# Altium schematic sheet fre_oa.SchDoc
size A4
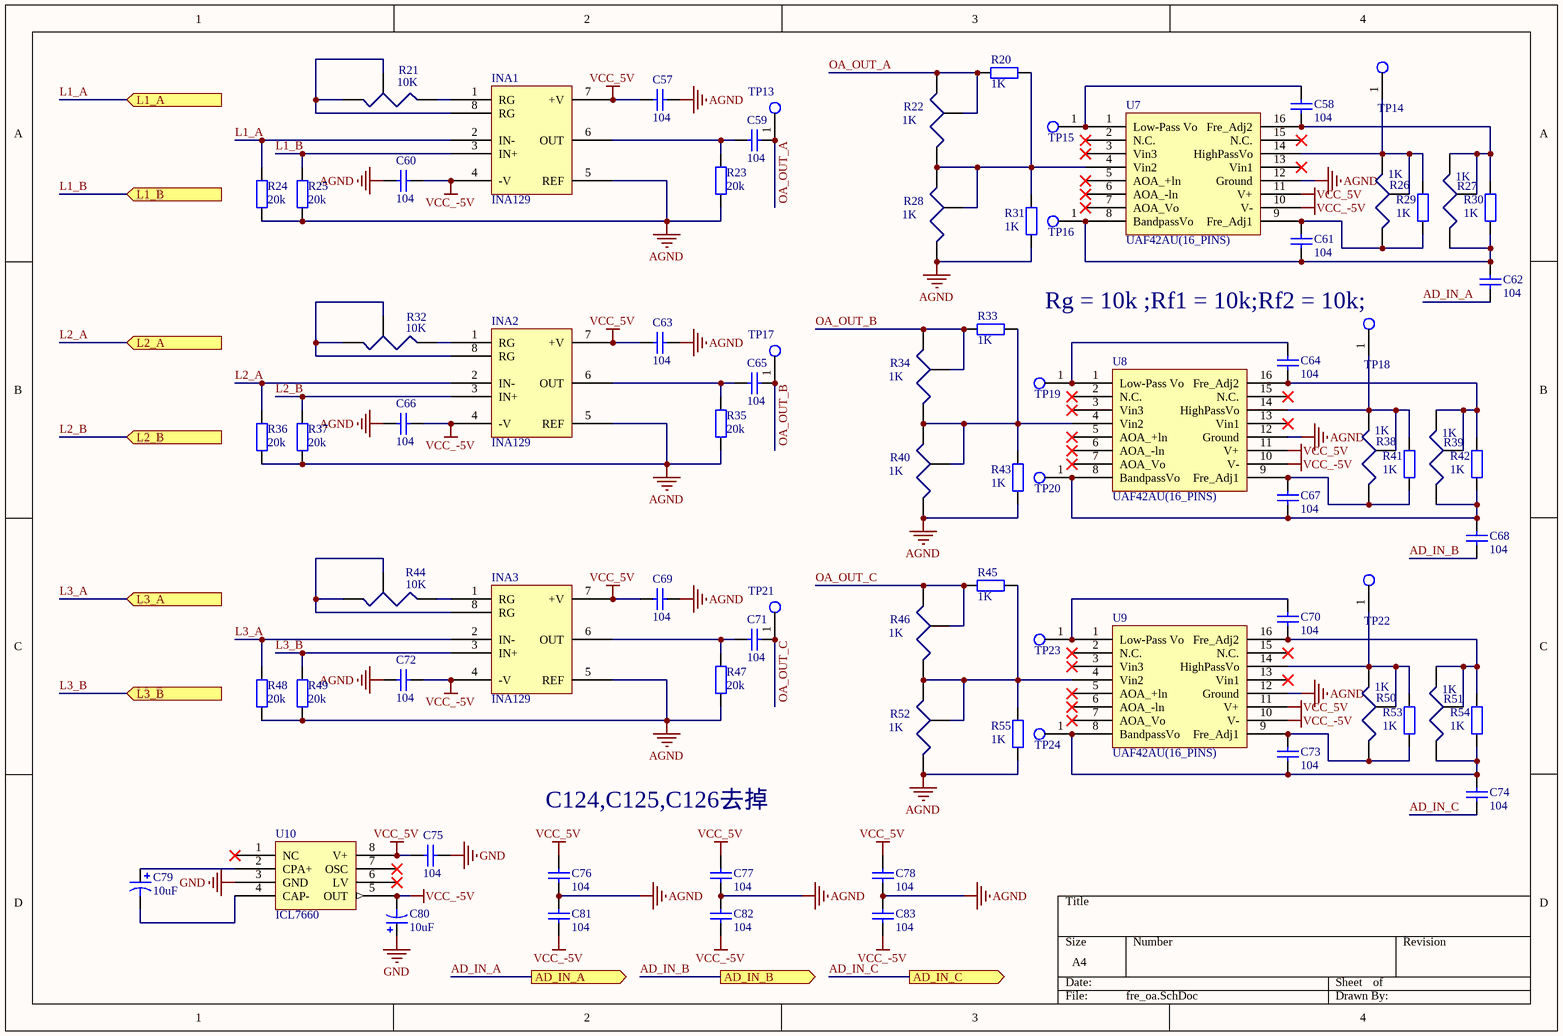
[diagram p0: fre_oa.SchDoc]

## Parts
C57  value 104  [0805]  (hidden comment: Cap)
C58  value 104  [0805]  (hidden comment: Cap)
C59  value 104  [0805]  (hidden comment: Cap)
C60  value 104  [0805]  (hidden comment: Cap)
C61  value 104  [0805]  (hidden comment: Cap)
C62  value 104  [0805]  (hidden comment: Cap)
C63  value 104  [0805]  (hidden comment: Cap)
C64  value 104  [0805]  (hidden comment: Cap)
C65  value 104  [0805]  (hidden comment: Cap)
C66  value 104  [0805]  (hidden comment: Cap)
C67  value 104  [0805]  (hidden comment: Cap)
C68  value 104  [0805]  (hidden comment: Cap)
C69  value 104  [0805]  (hidden comment: Cap)
C70  value 104  [0805]  (hidden comment: Cap)
C71  value 104  [0805]  (hidden comment: Cap)
C72  value 104  [0805]  (hidden comment: Cap)
C73  value 104  [0805]  (hidden comment: Cap)
C74  value 104  [0805]  (hidden comment: Cap)
C75  value 104  [0805]  (hidden comment: Cap)
C76  value 104  [0805]  (hidden comment: Cap)
C77  value 104  [0805]  (hidden comment: Cap)
C78  value 104  [0805]  (hidden comment: Cap)
C79  value 10uF  [Cap 3528B]  (hidden comment: Cap Poll)
C80  value 10uF  [Cap 3528B]  (hidden comment: Cap Poll)
C81  value 104  [0805]  (hidden comment: Cap)
C82  value 104  [0805]  (hidden comment: Cap)
C83  value 104  [0805]  (hidden comment: Cap)
INA1  INA129  [LM386]
INA2  INA129  [LM386]
INA3  INA129  [LM386]
R20  value 1K  [0805]  (hidden comment: Res)
R21  value 10K  [电位器WH06-2C]  (hidden comment: 电位器)
R22  value 1K  [电位器WH06-2C]  (hidden comment: 电位器)
R23  value 20k  [0805]  (hidden comment: Res)
R24  value 20k  [0805]  (hidden comment: Res)
R25  value 20k  [0805]  (hidden comment: Res)
R26  value 1K  [电位器WH06-2C]  (hidden comment: 电位器)
R27  value 1K  [电位器WH06-2C]  (hidden comment: 电位器)
R28  value 1K  [电位器WH06-2C]  (hidden comment: 电位器)
R29  value 1K  [0805]  (hidden comment: Res)
R30  value 1K  [0805]  (hidden comment: Res)
R31  value 1K  [0805]  (hidden comment: Res)
R32  value 10K  [电位器WH06-2C]  (hidden comment: 电位器)
R33  value 1K  [0805]  (hidden comment: Res)
R34  value 1K  [电位器WH06-2C]  (hidden comment: 电位器)
R35  value 20k  [0805]  (hidden comment: Res)
R36  value 20k  [0805]  (hidden comment: Res)
R37  value 20k  [0805]  (hidden comment: Res)
R38  value 1K  [电位器WH06-2C]  (hidden comment: 电位器)
R39  value 1K  [电位器WH06-2C]  (hidden comment: 电位器)
R40  value 1K  [电位器WH06-2C]  (hidden comment: 电位器)
R41  value 1K  [0805]  (hidden comment: Res)
R42  value 1K  [0805]  (hidden comment: Res)
R43  value 1K  [0805]  (hidden comment: Res)
R44  value 10K  [电位器WH06-2C]  (hidden comment: 电位器)
R45  value 1K  [0805]  (hidden comment: Res)
R46  value 1K  [电位器WH06-2C]  (hidden comment: 电位器)
R47  value 20k  [0805]  (hidden comment: Res)
R48  value 20k  [0805]  (hidden comment: Res)
R49  value 20k  [0805]  (hidden comment: Res)
R50  value 1K  [电位器WH06-2C]  (hidden comment: 电位器)
R51  value 1K  [电位器WH06-2C]  (hidden comment: 电位器)
R52  value 1K  [电位器WH06-2C]  (hidden comment: 电位器)
R53  value 1K  [0805]  (hidden comment: Res)
R54  value 1K  [0805]  (hidden comment: Res)
R55  value 1K  [0805]  (hidden comment: Res)
TP13  testPoint  [TP_H]  (value not drawn)
TP14  testPoint  [TP_H]  (value not drawn)
TP15  testPoint  [TP_H]  (value not drawn)
TP16  testPoint  [TP_H]  (value not drawn)
TP17  testPoint  [TP_H]  (value not drawn)
TP18  testPoint  [TP_H]  (value not drawn)
TP19  testPoint  [TP_H]  (value not drawn)
TP20  testPoint  [TP_H]  (value not drawn)
TP21  testPoint  [TP_H]  (value not drawn)
TP22  testPoint  [TP_H]  (value not drawn)
TP23  testPoint  [TP_H]  (value not drawn)
TP24  testPoint  [TP_H]  (value not drawn)
U7  UAF42AU(16_PINS)  [SOIC127P1030X265-16N]
U8  UAF42AU(16_PINS)  [SOIC127P1030X265-16N]
U9  UAF42AU(16_PINS)  [SOIC127P1030X265-16N]
U10  ICL7660  [ICL7660 sop-8]

## Ports
AD_IN_A (out), AD_IN_B (out), AD_IN_C (out), L1_A (in), L1_B (in), L2_A (in), L2_B (in), L3_A (in), L3_B (in)

## Nets
AGND: C57.2 C60.1 C63.2 C66.1 C69.2 C72.1 C76.1 C77.1 C78.1 C81.2 C82.2 C83.2 INA1.5(REF) INA2.5(REF) INA3.5(REF) R23.1 R24.1 R25.1 R28.1 R31.1 R35.1 R36.1 R37.1 R40.1 R43.1 R47.1 R48.1 R49.1 R52.1 R55.1 U7.12(Ground) U8.12(Ground) U9.12(Ground)
GND: C75.2 C80.1 U10.3(GND)
VCC_5V: C57.1 C63.1 C69.1 C75.1 C76.2 C77.2 C78.2 INA1.7(+V) INA2.7(+V) INA3.7(+V) U7.11(V+) U8.11(V+) U9.11(V+) U10.8(V+)
VCC_-5V: C60.2 C66.2 C72.2 C80.2 C81.1 C82.1 C83.1 INA1.4(-V) INA2.4(-V) INA3.4(-V) U7.10(V-) U8.10(V-) U9.10(V-) U10.5(OUT)
AD_IN_A: C62.2 ; port AD_IN_A
AD_IN_B: C68.2 ; port AD_IN_B
AD_IN_C: C74.2 ; port AD_IN_C
L1_A: INA1.2(IN-) R24.2 ; port L1_A
L1_B: INA1.3(IN+) R25.2 ; port L1_B
L2_A: INA2.2(IN-) R36.2 ; port L2_A
L2_B: INA2.3(IN+) R37.2 ; port L2_B
L3_A: INA3.2(IN-) R48.2 ; port L3_A
L3_B: INA3.3(IN+) R49.2 ; port L3_B
OA_OUT_A: C59.2 R20.1 R22.2 R22.3 TP13.1
OA_OUT_B: C65.2 R33.1 R34.2 R34.3 TP17.1
OA_OUT_C: C71.2 R45.1 R46.2 R46.3 TP21.1
NetC58_1: C58.1 TP15.1 U7.1(Low-Pass_Vo)
NetC58_2: C58.2 R27.2 R27.3 R30.2 U7.16(Fre_Adj2)
NetC59_1: C59.1 INA1.6(OUT) R23.2
NetC61_1: C61.1 R26.1 R29.1 U7.9(Fre_Adj1)
NetC61_2: C61.2 C62.1 R27.1 R30.1 TP16.1 U7.8(BandpassVo)
NetC64_1: C64.1 TP19.1 U8.1(Low-Pass_Vo)
NetC64_2: C64.2 R39.2 R39.3 R42.2 U8.16(Fre_Adj2)
NetC65_1: C65.1 INA2.6(OUT) R35.2
NetC67_1: C67.1 R38.1 R41.1 U8.9(Fre_Adj1)
NetC67_2: C67.2 C68.1 R39.1 R42.1 TP20.1 U8.8(BandpassVo)
NetC70_1: C70.1 TP23.1 U9.1(Low-Pass_Vo)
NetC70_2: C70.2 R51.2 R51.3 R54.2 U9.16(Fre_Adj2)
NetC71_1: C71.1 INA3.6(OUT) R47.2
NetC73_1: C73.1 R50.1 R53.1 U9.9(Fre_Adj1)
NetC73_2: C73.2 C74.1 R51.1 R54.1 TP24.1 U9.8(BandpassVo)
NetC79_1: C79.1 U10.2(CPA+)
NetC79_2: C79.2 U10.4(CAP-)
NetINA1_1: INA1.1(RG) R21.1
NetINA1_8: INA1.8(RG) R21.2 R21.3
NetINA2_1: INA2.1(RG) R32.1
NetINA2_8: INA2.8(RG) R32.2 R32.3
NetINA3_1: INA3.1(RG) R44.1
NetINA3_8: INA3.8(RG) R44.2 R44.3
NetR20_2: R20.2 R22.1 R28.2 R28.3 R31.2 U7.4(Vin2)
NetR26_2: R26.2 R26.3 R29.2 TP14.1 U7.14(HighPassVo)
NetR33_2: R33.2 R34.1 R40.2 R40.3 R43.2 U8.4(Vin2)
NetR38_2: R38.2 R38.3 R41.2 TP18.1 U8.14(HighPassVo)
NetR45_2: R45.2 R46.1 R52.2 R52.3 R55.2 U9.4(Vin2)
NetR50_2: R50.2 R50.3 R53.2 TP22.1 U9.14(HighPassVo)

Not connected (* = marked no-connect by the designer): U7 2(N.C.)* 3(Vin3)* 5(AOA_+ln)* 6(AOA_-ln)* 7(AOA_Vo)* 13(Vin1)* 15(N.C.)*; U8 2(N.C.)* 3(Vin3)* 5(AOA_+ln)* 6(AOA_-ln)* 7(AOA_Vo)* 13(Vin1)* 15(N.C.)*; U9 2(N.C.)* 3(Vin3)* 5(AOA_+ln)* 6(AOA_-ln)* 7(AOA_Vo)* 13(Vin1)* 15(N.C.)*; U10 1(NC)* 6(LV)* 7(OSC)*

## Notes on the sheet
- (near TP18) Rg = 10k ;Rf1 = 10k;Rf2 = 10k;
- C124,C125,C126去掉

## Library data of the parts
C57-C78 C81-C83 = Cap: 原理图绘制者: 刘永钦; 原理图何处使用过: 2014年飞思卡尔底板; 原理图审核人1: 徐鹏飞; 封装0805何处使用: 2015年航行器遥控器; 原理图审核人2: 朱觉文; 封装0603何处使用过: 在2401转接板上使用; Pressure Voltage: 16V; 原理图提供者: 刘永钦; 封装0805绘制者: 刘永钦; 封装0805提供者: 刘永钦; 封装0805审核人1: 徐鹏飞; 封装0805审核人2: 朱觉文; 封装0603绘制者: 刘永钦; 封装0603提供者: 刘永钦; 封装0603审核人1: 朱觉文; 封装0603审核人2: 徐鹏飞
C79 C80 = Cap Poll: 原理图绘制者: 刘永钦; 原理图何处使用过: 2014年飞思卡尔底板; 原理图审核人1: 徐鹏飞; 封装CAP 钽 7343 E何处使用: 2014年飞思卡尔驱动板; 封装cap贴片铝电解质470uF 16V绘制者: 李泽; 封装cap贴片铝电解质470uF 16V何处使用: 2015年飞思卡尔主板; 封装Cap 3528B绘制者: 陈汉诚; 封装Cap 3528B使用过: 2015年飞思卡尔驱动板; 封装Cap直插 10uF 50V: 10级718学长; 封装Cap直插 10uF 50V使用过: 2012年XS128学习板的主板; 封装Cap 3528B审核人2: 朱觉文; Pressure Voltage: 16V; 原理图提供者: 刘永钦; 封装CAP 钽 7343 E绘制者: 刘永钦; 封装CAP 钽 7343 E提供者: 刘永钦; 封装CAP 钽 7343 E审核人1: 徐鹏飞; 封装cap贴片铝电解质470uF 16V提供者: 刘永钦; 封装cap贴片铝电解质470uF 16V审核人1: 徐鹏飞; 封装Cap 3528B提供者: 刘永钦; 封装Cap 3528B审核人1: 徐鹏飞; 封装Cap直插 10uF 50V提供者: 刘永钦; 封装Cap直插 10uF 50V审核人1: 徐鹏飞; 封装Cap直插 10uF 50V审核人2: 朱觉文; 封装cap贴片铝电解质470uF 16V审核人2: 朱觉文; 封装CAP 钽 7343 E审核人2: 朱觉文; 原理图审核人2: 朱觉文
R20 R23-R25 R29-R31 R33 R35-R37 R41-R43 R45 R47-R49 R53-R55 = Res: 原理图绘制者: 刘永钦; 原理图何处使用过: 2014年飞思卡尔底板; 原理图审核人1: 徐鹏飞; 封装0805何处使用过: 2015年航行器遥控器; 原理图审核人2: 朱觉文; 封装2512-RESC6332X06N何处使用过: 在无刷直流电机驱动板上使用过; 封装0603何处使用过: 在2401转接板上使用; 原理图提供者: 刘永钦; 封装0805绘制者: 刘永钦; 封装0805提供者: 刘永钦; 封装0805审核人1: 徐鹏飞; 封装0805审核人2: 朱觉文; 封装0603提供者: 刘永钦; 封装0603审核人2: 朱觉文; 封装0603审核人1: 徐鹏飞; 封装2512-RESC6332X06N审核人2: 朱觉文; 封装2512-RESC6332X06N提供者: 刘永钦; 封装2512-RESC6332X06N审核人1: 徐鹏飞; 封装0603绘制者: 刘永钦; 封装2512-RESC6332X06N绘制者: 刘永钦
R21 R22 R26-R28 R32 R34 R38-R40 R44 R46 R50-R52 = 电位器: 原理图绘制者: 刘永钦; 原理图何处使用过: 2014年飞思卡尔底板; 原理图审核人1: 徐鹏飞; 封装电位器WH06-2C使用过: 2014年小板子; 封装电位器 097单联弯脚使用过: 2015年航行器遥控器; 原理图审核人2: 朱觉文; 原理图提供者: 刘永钦; 封装电位器WH06-2C绘制者: 刘永钦; 封装电位器WH06-2C审核人1: 徐鹏飞; 封装电位器WH06-2C提供者: 刘永钦; 封装电位器 097单联弯脚绘制者: 刘永钦; 封装电位器 097单联弯脚提供者: 刘永钦; 封装电位器 097单联弯脚审核人1: 徐鹏飞; 封装电位器 097单联弯脚审核人2: 朱觉文; 封装电位器WH06-2C审核人2: 朱觉文
TP13-TP24 = TP
U10 = ICL7660: 原理图绘制者: 刘永钦; 原理图何处使用过: 2014年飞思卡尔底板; 原理图审核人1: 徐鹏飞; 封装ICL7660 sop-8使用过: 2014年飞思卡尔地板; 原理图审核人2: 朱觉文; 原理图提供者: 刘永钦; 封装ICL7660 sop-8绘制者: 刘永钦; 封装ICL7660 sop-8审核人1: 徐鹏飞; 封装ICL7660 sop-8提供者: 刘永钦; 封装ICL7660 sop-8审核人2: 朱觉文